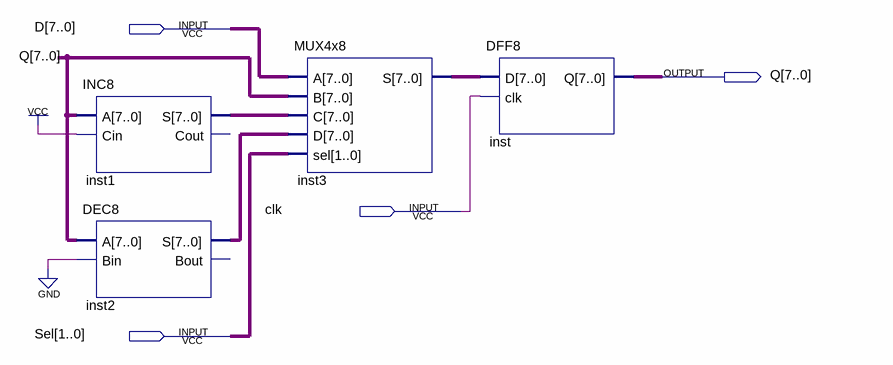
[diagram p0: schematic sheet]
// Quartus schematic CUD8.bdf as structural Verilog: 4 symbols, 4 pins
module CUD8 (
  input  [7:0] D,
  input  clk,
  input  [1:0] Sel,
  output [7:0] Q
);

  wire [7:0] inst1_s, inst2_s, inst3_s;

  INC8 inst1 (.A(Q), .Cin(1'b1), .S(inst1_s));  // open: Cout
  DEC8 inst2 (.A(Q), .Bin(1'b0), .S(inst2_s));  // open: Bout
  MUX4x8 inst3 (.A(D), .B(Q), .C(inst1_s), .D(inst2_s), .sel(Sel), .S(inst3_s));
  DFF8 inst (.D(inst3_s), .clk(clk), .Q(Q));
endmodule
